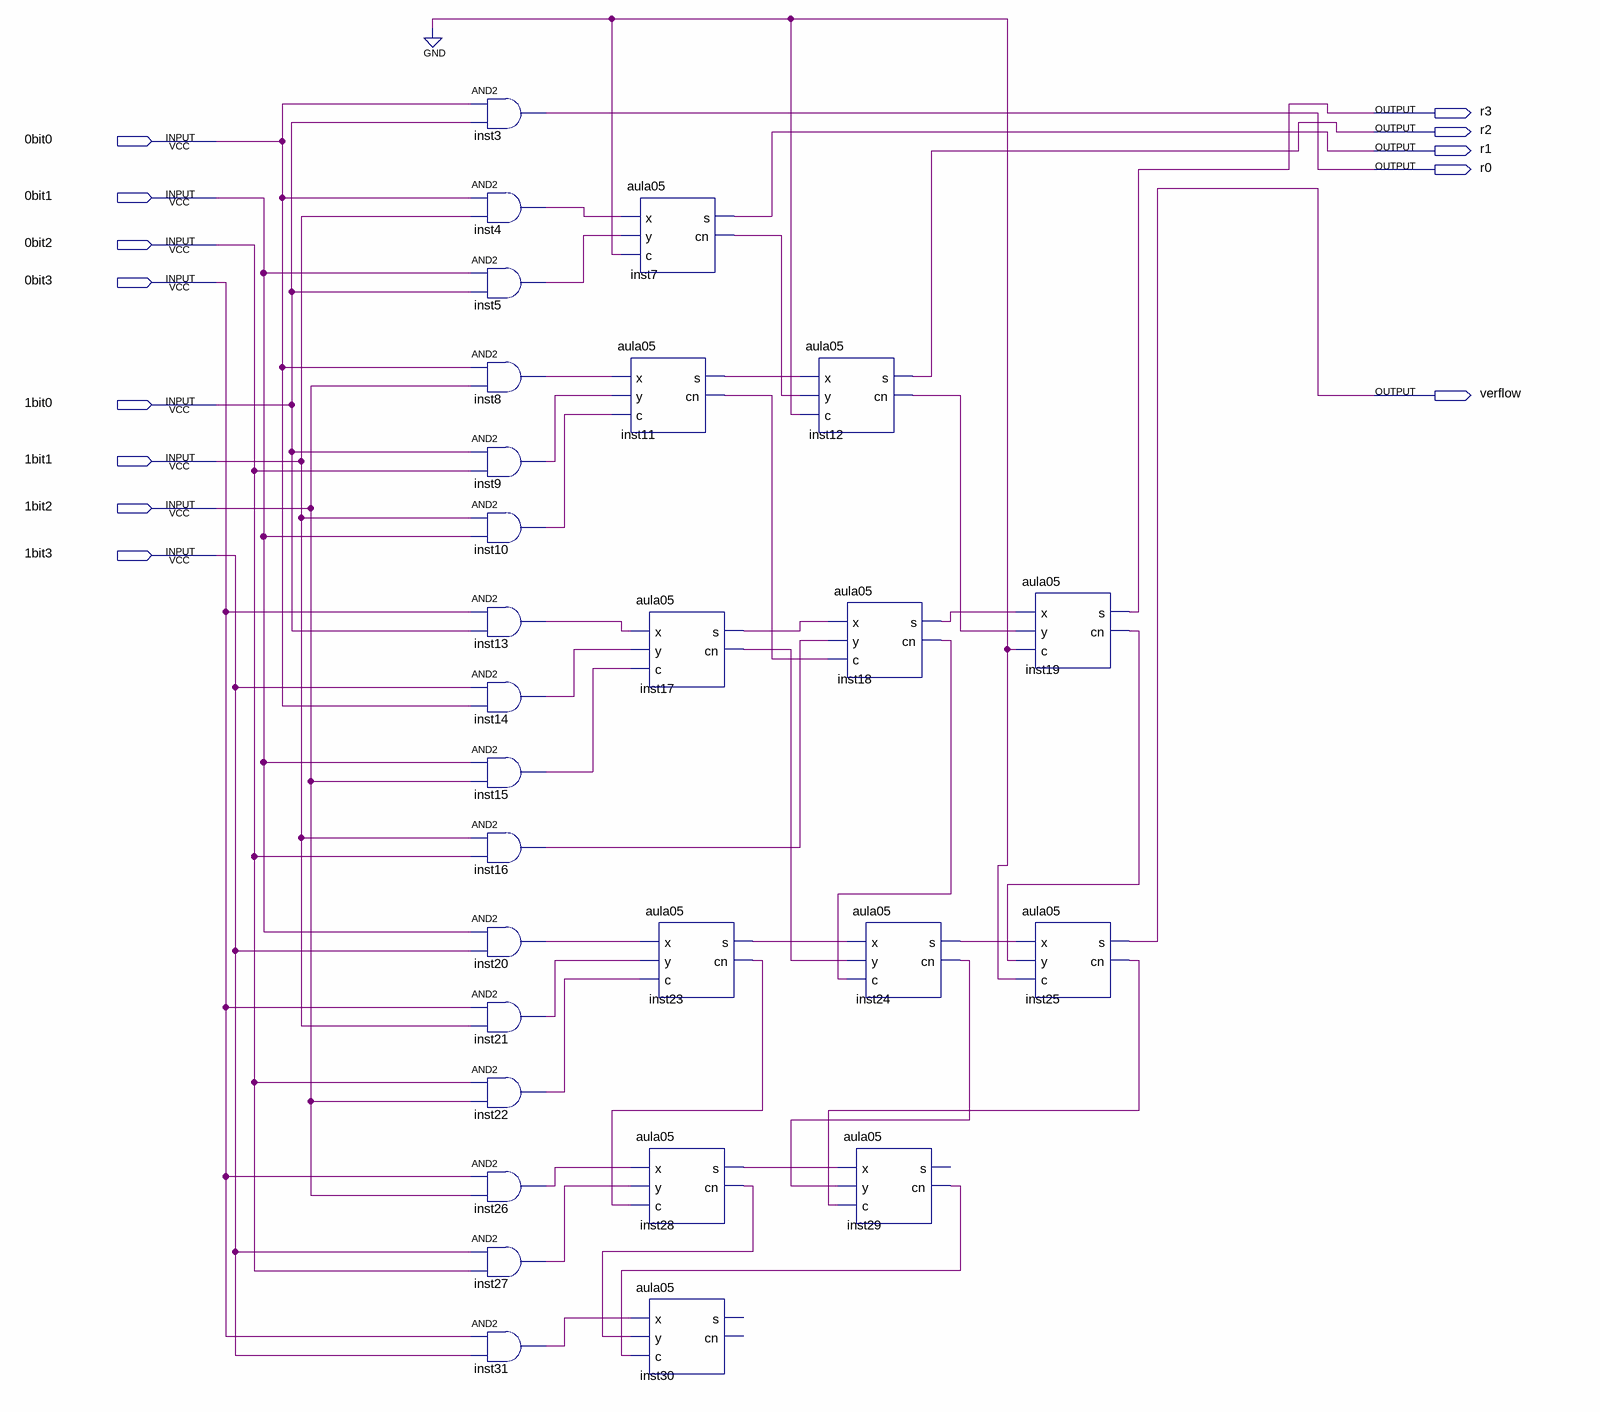
[diagram p0: schematic sheet]
// Quartus schematic aula10.bdf as structural Verilog: 28 symbols, 13 pins
module aula10 (
  input  \0bit0 ,
  input  \0bit1 ,
  input  \0bit2 ,
  input  \0bit3 ,
  input  \1bit0 ,
  input  \1bit1 ,
  input  \1bit2 ,
  input  \1bit3 ,
  output r3,
  output r2,
  output r1,
  output r0,
  output verflow
);

  wire inst4_out, inst5_out, inst7_cn, inst8_out, inst9_out, inst10_out, inst11_cn, inst11_s, inst12_cn,
       inst13_out, inst14_out, inst15_out, inst16_out, inst17_cn, inst17_s, inst18_cn, inst18_s, inst19_cn,
       inst20_out, inst21_out, inst22_out, inst23_cn, inst23_s, inst24_cn, inst24_s, inst25_cn, inst26_out,
       inst27_out, inst28_cn, inst28_s, inst29_cn, inst31_out;

  and inst3 (r0, \0bit0 , \1bit0 );
  and inst4 (inst4_out, \0bit0 , \1bit1 );
  and inst5 (inst5_out, \0bit1 , \1bit0 );
  and inst8 (inst8_out, \0bit0 , \1bit2 );
  and inst9 (inst9_out, \1bit0 , \0bit2 );
  and inst10 (inst10_out, \1bit1 , \0bit1 );
  and inst13 (inst13_out, \0bit3 , \1bit0 );
  and inst14 (inst14_out, \1bit3 , \0bit0 );
  and inst15 (inst15_out, \0bit1 , \1bit2 );
  and inst16 (inst16_out, \1bit1 , \0bit2 );
  and inst20 (inst20_out, \0bit1 , \1bit3 );
  and inst21 (inst21_out, \0bit3 , \1bit1 );
  and inst22 (inst22_out, \0bit2 , \1bit2 );
  and inst26 (inst26_out, \0bit3 , \1bit2 );
  and inst27 (inst27_out, \1bit3 , \0bit2 );
  and inst31 (inst31_out, \0bit3 , \1bit3 );
  aula05 inst7 (.x(inst4_out), .y(inst5_out), .c(1'b0), .s(r1), .cn(inst7_cn));
  aula05 inst11 (.x(inst8_out), .y(inst9_out), .c(inst10_out), .s(inst11_s), .cn(inst11_cn));
  aula05 inst17 (.x(inst13_out), .y(inst14_out), .c(inst15_out), .s(inst17_s), .cn(inst17_cn));
  aula05 inst23 (.x(inst20_out), .y(inst21_out), .c(inst22_out), .s(inst23_s), .cn(inst23_cn));
  aula05 inst28 (.x(inst26_out), .y(inst27_out), .c(inst23_cn), .s(inst28_s), .cn(inst28_cn));
  aula05 inst30 (.x(inst31_out), .y(inst28_cn), .c(inst29_cn));  // open: s, cn
  aula05 inst12 (.x(inst11_s), .y(inst7_cn), .c(1'b0), .s(r2), .cn(inst12_cn));
  aula05 inst18 (.x(inst17_s), .y(inst16_out), .c(inst11_cn), .s(inst18_s), .cn(inst18_cn));
  aula05 inst24 (.x(inst23_s), .y(inst17_cn), .c(inst18_cn), .s(inst24_s), .cn(inst24_cn));
  aula05 inst29 (.x(inst28_s), .y(inst24_cn), .c(inst25_cn), .cn(inst29_cn));  // open: s
  aula05 inst19 (.x(inst18_s), .y(inst12_cn), .c(1'b0), .s(r3), .cn(inst19_cn));
  aula05 inst25 (.x(inst24_s), .y(inst19_cn), .c(1'b0), .s(verflow), .cn(inst25_cn));
endmodule
